# Altium project PCB_Project.PrjPcb (part 1 of 3)
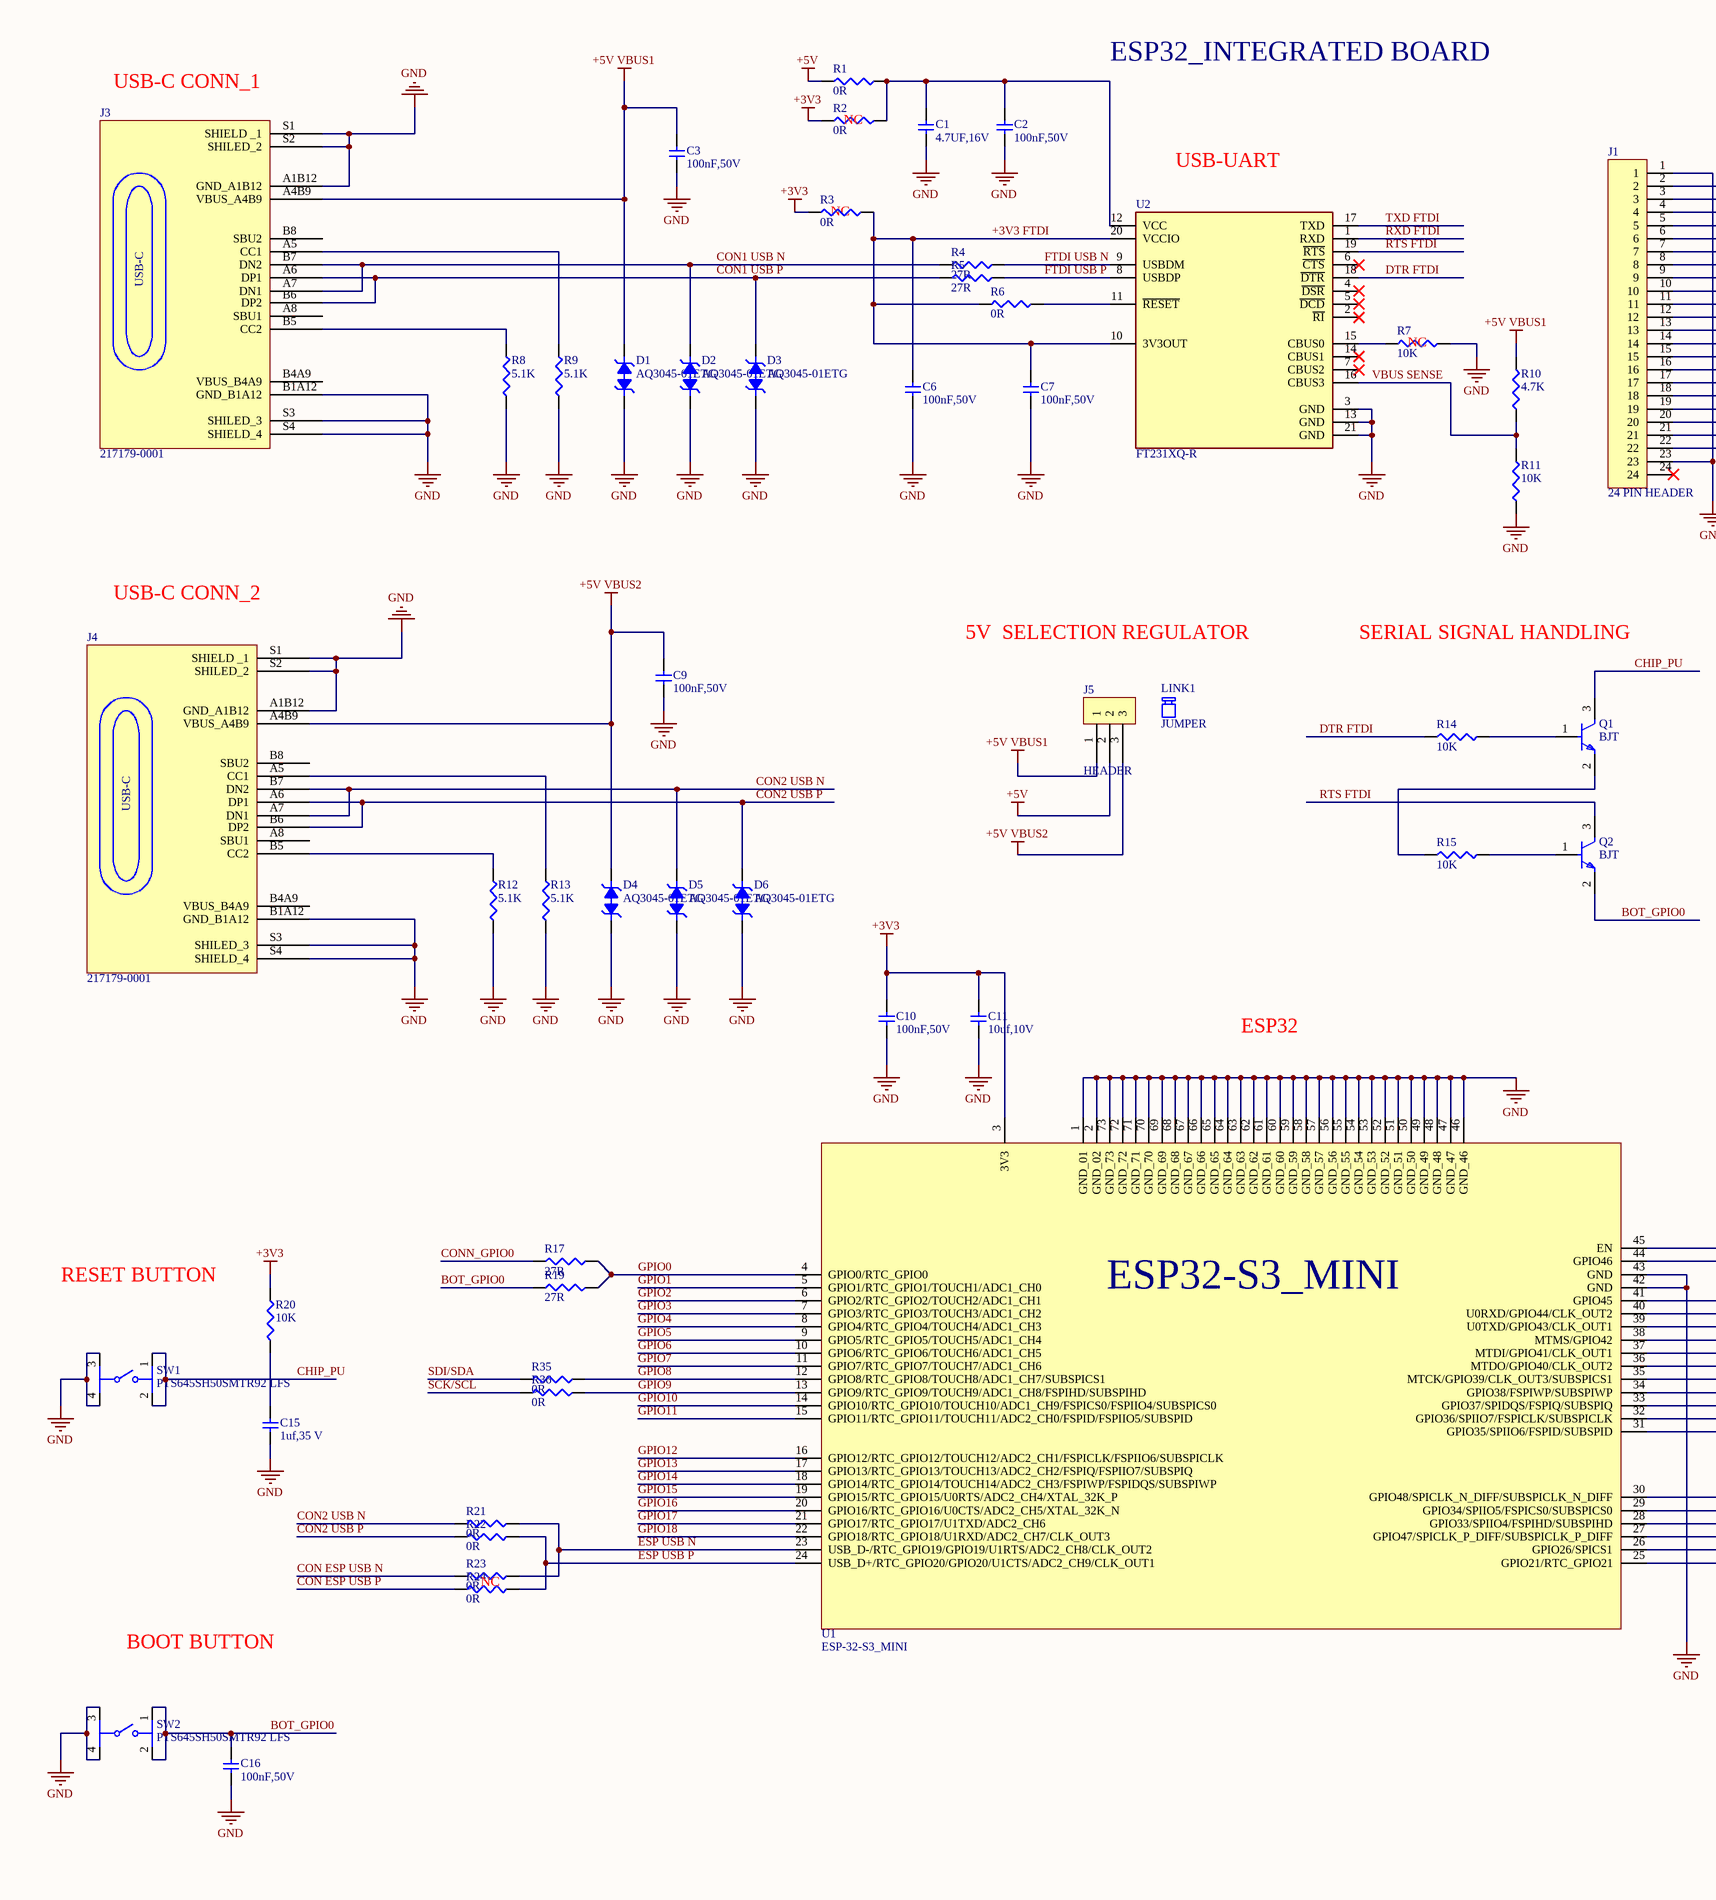
[diagram p0: esp.SchDoc, left]
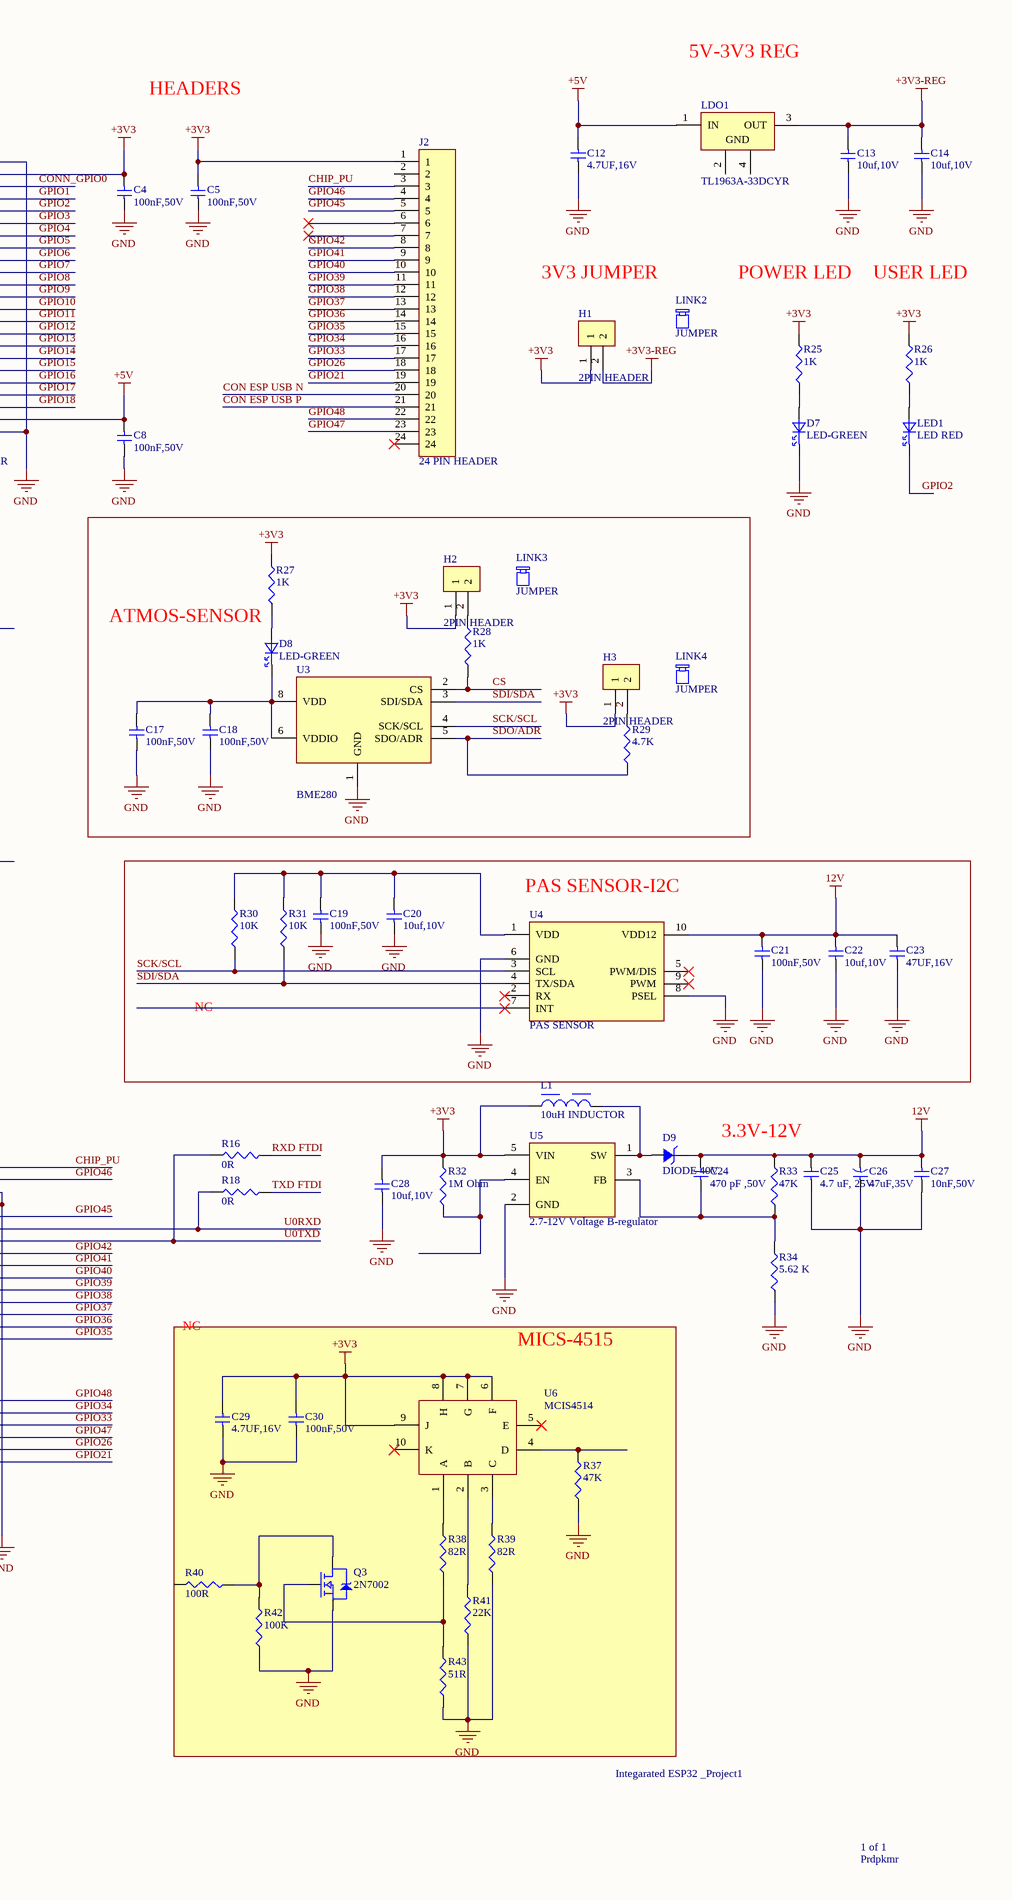
[diagram p1: esp.SchDoc, right]
1 sheet, 108 parts. Net scope: global (net labels, ports and power ports of the same name join across sheets).
Board file: PCB1.PcbDoc

## Sheet esp.SchDoc
size A2; SheetNumber: 1; SheetTotal: 1

### Parts
C1  4.7UF,16V  [CAPC1005X55N]
C2  100nF,50V  [CAPC1005X55N]
C3  100nF,50V  [CAPC1005X55N]
C4  100nF,50V  [CAPC1005X55N]
C5  100nF,50V  [CAPC1005X55N]
C6  100nF,50V  [CAPC1005X55N]
C7  100nF,50V  [CAPC1005X55N]
C8  100nF,50V  [CAPC1005X55N]
C9  100nF,50V  [CAPC1005X55N]
C10  100nF,50V  [CAPC1005X55N]
C11  10uf,10V  [CAPC1005X55N]
C12  4.7UF,16V  [CAPC1005X55N]
C13  10uf,10V  [CAPC1005X55N]
C14  10uf,10V  [CAPC1005X55N]
C15  1uf,35 V  [CAPC1005X55N]
C16  100nF,50V  [CAPC1005X55N]
C17  100nF,50V  [CAPC1005X55N]
C18  100nF,50V  [CAPC1005X55N]
C19  100nF,50V  [CAPC1005X55N]
C20  10uf,10V  [CAPC1005X55N]
C21  100nF,50V  [CAPC1005X55N]
C22  10uf,10V  [CAPC1005X55N]
C23  47UF,16V  [CAPC1005X55N]
C24  470 pF ,50V  [CAPC1005X55N]
C25  4.7 uF, 25V  [CAPC1005X55N]
C26  47uF,35V
C27  10nF,50V  [CAPC1005X55N]
C28  10uf,10V  [CAPC1005X55N]
C29  4.7UF,16V  [CAPC1005X55N]
C30  100nF,50V  [CAPC1005X55N]
D1  AQ3045-01ETG  [DIODFN100X60X50-2N]
D2  AQ3045-01ETG  [DIODFN100X60X50-2N]
D3  AQ3045-01ETG  [DIODFN100X60X50-2N]
D4  AQ3045-01ETG  [DIODFN100X60X50-2N]
D5  AQ3045-01ETG  [DIODFN100X60X50-2N]
D6  AQ3045-01ETG  [DIODFN100X60X50-2N]
D7  LED-GREEN  [LED0402_G]
D8  LED-GREEN  [LED0402_G]
D9  DIODE 40V
H1  2PIN HEADER  [HDR_1X2-1.27MM]
H2  2PIN HEADER  [HDR_1X2-1.27MM]
H3  2PIN HEADER  [HDR_1X2-1.27MM]
J1  24 PIN HEADER  [hdr_1x24]
J2  24 PIN HEADER  [hdr_1x24]
J3  217179-0001  [FP-2171790001-MFG]
J4  217179-0001  [FP-2171790001-MFG]
J5  HEADER  [HDR_1X3_1.27mm]
L1  10uH INDUCTOR  [WE-LQS_2010]
LDO1  TL1963A-33DCYR  [DCY0004A_N]
LED1  LED RED  [LED0402_R]
LINK1  JUMPER
LINK2  JUMPER
LINK3  JUMPER
LINK4  JUMPER
Q1  BJT  [FP-SS8050-G-IPC_B]
Q2  BJT  [FP-SS8050-G-IPC_B]
Q3  2N7002  [SOT95P240X111-3N]
R1  0R  [RESC1005X37N]
R2  0R  [RESC1005X37N]
R3  0R  [RESC1005X37N]
R4  27R  [RESC1005X37N]
R5  27R  [RESC1005X37N]
R6  0R  [RESC1005X37N]
R7  10K  [RESC1005X37N]
R8  5.1K  [RESC1005X37N]
R9  5.1K  [RESC1005X37N]
R10  4.7K  [RESC1005X37N]
R11  10K  [RESC1005X37N]
R12  5.1K  [RESC1005X37N]
R13  5.1K  [RESC1005X37N]
R14  10K  [RESC1005X37N]
R15  10K  [RESC1005X37N]
R16  0R  [RESC1005X37N]
R17  27R  [RESC1005X37N]
R18  0R  [RESC1005X37N]
R19  27R  [RESC1005X37N]
R20  10K  [RESC1005X37N]
R21  0R  [RESC1005X37N]
R22  0R  [RESC1005X37N]
R23  0R  [RESC1005X37N]
R24  0R  [RESC1005X37N]
R25  1K  [RESC1005X37N]
R26  1K  [RESC1005X37N]
R27  1K  [RESC1005X37N]
R28  1K  [RESC1005X37N]
R29  4.7K  [RESC1005X37N]
R30  10K  [RESC1005X37N]
R31  10K  [RESC1005X37N]
R32  1M Ohm  [RESC1005X37N]
R33  47K  [RESC1005X37N]
R34  5.62 K  [RESC1005X37N]
R35  0R  [RESC1005X37N]
R36  0R  [RESC1005X37N]
R37  47K  [RESC1005X37N]
R38  82R  [RESC1005X37N]
R39  82R  [RESC1005X37N]
R40  100R  [RESC1005X37N]
R41  22K  [RESC1005X37N]
R42  100K  [RESC1005X37N]
R43  51R  [RESC1005X37N]
SW1  PTS645SH50SMTR92 LFS  [FP-PTS645SH50SMTR92LFS-MFG]
SW2  PTS645SH50SMTR92 LFS  [FP-PTS645SH50SMTR92LFS-MFG]
U1  ESP-32-S3_MINI  [XCVR_ESP32-S3-MINI-1-N8]
U2  FT231XQ-R  [FP-QFN-20-IPC_B]
U3  BME280  [PSON65P250X250X100-8N]
U4  PAS SENSOR  [PQFN50P300X300X80-16N]
U5  2.7-12V Voltage B-regulator  [SOT95P280X145-5N]
U6  MCIS4514

### Blocks framed on the sheet
ATMOS-SENSOR: C17 C18 D8 H2 H3 LINK3 LINK4 R27-R29 U3
PAS SENSOR-I2C: C19-C23 R30 R31 U4
MICS-4515: C29 C30 Q3 R37-R43 U6

### Nets
12V: C21.2 C22.2 C23.2 C24.2 C25.2 C26.2 C27.2 D9.2 R33.2 U4.10(VDD12)
+3V3: C4.2 C5.2 C10.2 C11.2 C28.2 C29.2 C30.2 H1.1 H2.1 H3.1 J1.2 J2.1 L1.1 R2.2 R3.2 R20.1 R25.2 R26.2 R27.2 R32.2 U1.3(3V3) U5.5(VIN) U6.6(F) U6.7(G) U6.8(H) U6.9(J)
+3V3-REG: C13.2 C14.2 H1.2 LDO1.3(OUT)
+5V: C8.2 C12.1 J1.22 J5.2 LDO1.1(IN) R1.2
+5V VBUS1: C3.2 D1.1 J3.A4B9(VBUS_A4B9) J5.1 R10.2
+5V VBUS2: C9.2 D4.1 J4.A4B9(VBUS_A4B9) J5.3
GND: C1.2 C2.1 C3.1 C4.1 C5.1 C6.1 C7.1 C8.1 C9.1 C10.1 C11.1 C12.2 C13.1 C14.1 C15.1 C16.1 C17.1 C18.1 C19.1 C20.1 C21.1 C22.1 C23.1 C25.1 C26.1 C27.1 C28.1 C29.1 C30.1 D1.2 D2.2 D3.2 D4.2 D5.2 D6.2 D7.1 J1.1 J1.23 J3.A1B12(GND_A1B12) J3.B1A12(GND_B1A12) J3.S1(SHIELD__1) J3.S2(SHILED_2) J3.S3(SHILED_3) J3.S4(SHIELD_4) J4.A1B12(GND_A1B12) J4.B1A12(GND_B1A12) J4.S1(SHIELD__1) J4.S2(SHILED_2) J4.S3(SHILED_3) J4.S4(SHIELD_4) Q3.3 R7.1 R8.2 R9.2 R11.2 R12.2 R13.2 R34.1 R37.1 R39.1 R41.1 R42.1 R43.1 SW1.3 SW1.4 SW2.3 SW2.4 U1.1(GND_01) U1.2(GND_02) U1.42(GND) U1.43(GND) U1.46(GND_46) U1.47(GND_47) U1.48(GND_48) U1.49(GND_49) U1.50(GND_50) U1.51(GND_51) U1.52(GND_52) U1.53(GND_53) U1.54(GND_54) U1.55(GND_55) U1.56(GND_56) U1.57(GND_57) U1.58(GND_58) U1.59(GND_59) U1.60(GND_60) U1.61(GND_61) U1.62(GND_62) U1.63(GND_63) U1.64(GND_64) U1.65(GND_65) U1.66(GND_66) U1.67(GND_67) U1.68(GND_68) U1.69(GND_69) U1.70(GND_70) U1.71(GND_71) U1.72(GND_72) U1.73(GND_73) U2.3(GND) U2.13(GND) U2.21(GND) U3.1(GND) U4.6(GND) U4.8(PSEL) U5.2(GND)
+3V3 FTDI: C6.2 C7.2 R3.1 R6.2 U2.10(3V3OUT) U2.20(VCCIO)
BOT_GPIO0: C16.2 Q2.2(E) R19.1 SW2.1 SW2.2
CHIP_PU: J2.3 Q1.3(C) SW1.1 SW1.2 U1.45(EN)
CON1 USB N: D2.1 J3.A7(DN1) J3.B7(DN2) R4.1
CON1 USB P: D3.1 J3.A6(DP1) J3.B6(DP2) R5.1
CON2 USB N: D5.1 J4.A7(DN1) J4.B7(DN2) R21.2
CON2 USB P: D6.1 J4.A6(DP1) J4.B6(DP2) R22.2
CON ESP USB N: J2.20 R23.2
CON ESP USB P: J2.21 R24.2
CONN_GPIO0: J1.3 R17.1
CS: R28.2 U3.2(CS)
DTR FTDI: R14.1 U2.18(~{DTR})
ESP USB N: R21.1 R23.1 U1.23(USB_D-/RTC_GPIO19/GPIO19/U1RTS/ADC2_CH8/CLK_OUT2)
ESP USB P: R22.1 R24.1 U1.24(USB_D+/RTC_GPIO20/GPIO20/U1CTS/ADC2_CH9/CLK_OUT1)
FTDI USB N: R4.2 U2.9(USBDM)
FTDI USB P: R5.2 U2.8(USBDP)
GPIO0: R17.2 R19.2 U1.4(GPIO0/RTC_GPIO0)
GPIO1: J1.4 U1.5(GPIO1/RTC_GPIO1/TOUCH1/ADC1_CH0)
GPIO2: J1.5 LED1.1 U1.6(GPIO2/RTC_GPIO2/TOUCH2/ADC1_CH1)
GPIO3: J1.6 U1.7(GPIO3/RTC_GPIO3/TOUCH3/ADC1_CH2)
GPIO4: J1.7 U1.8(GPIO4/RTC_GPIO4/TOUCH4/ADC1_CH3)
GPIO5: J1.8 U1.9(GPIO5/RTC_GPIO5/TOUCH5/ADC1_CH4)
GPIO6: J1.9 U1.10(GPIO6/RTC_GPIO6/TOUCH6/ADC1_CH5)
GPIO7: J1.10 U1.11(GPIO7/RTC_GPIO7/TOUCH7/ADC1_CH6)
GPIO8: J1.11 R35.1 U1.12(GPIO8/RTC_GPIO8/TOUCH8/ADC1_CH7/SUBSPICS1)
GPIO9: J1.12 R36.1 U1.13(GPIO9/RTC_GPIO9/TOUCH9/ADC1_CH8/FSPIHD/SUBSPIHD)
GPIO10: J1.13 U1.14(GPIO10/RTC_GPIO10/TOUCH10/ADC1_CH9/FSPICS0/FSPIIO4/SUBSPICS0)
GPIO11: J1.14 U1.15(GPIO11/RTC_GPIO11/TOUCH11/ADC2_CH0/FSPID/FSPIIO5/SUBSPID)
GPIO12: J1.15 U1.16(GPIO12/RTC_GPIO12/TOUCH12/ADC2_CH1/FSPICLK/FSPIIO6/SUBSPICLK)
GPIO13: J1.16 U1.17(GPIO13/RTC_GPIO13/TOUCH13/ADC2_CH2/FSPIQ/FSPIIO7/SUBSPIQ)
GPIO14: J1.17 U1.18(GPIO14/RTC_GPIO14/TOUCH14/ADC2_CH3/FSPIWP/FSPIDQS/SUBSPIWP)
GPIO15: J1.18 U1.19(GPIO15/RTC_GPIO15/U0RTS/ADC2_CH4/XTAL_32K_P)
GPIO16: J1.19 U1.20(GPIO16/RTC_GPIO16/U0CTS/ADC2_CH5/XTAL_32K_N)
GPIO17: J1.20 U1.21(GPIO17/RTC_GPIO17/U1TXD/ADC2_CH6)
GPIO18: J1.21 U1.22(GPIO18/RTC_GPIO18/U1RXD/ADC2_CH7/CLK_OUT3)
GPIO21: J2.19 U1.25(GPIO21/RTC_GPIO21)
GPIO26: J2.18 U1.26(GPIO26/SPICS1)
GPIO33: J2.17 U1.28(GPIO33/SPIIO4/FSPIHD/SUBSPIHD)
GPIO34: J2.16 U1.29(GPIO34/SPIIO5/FSPICS0/SUBSPICS0)
GPIO35: J2.15 U1.31(GPIO35/SPIIO6/FSPID/SUBSPID)
GPIO36: J2.14 U1.32(GPIO36/SPIIO7/FSPICLK/SUBSPICLK)
GPIO37: J2.13 U1.33(GPIO37/SPIDQS/FSPIQ/SUBSPIQ)
GPIO38: J2.12 U1.34(GPIO38/FSPIWP/SUBSPIWP)
GPIO39: J2.11 U1.35(MTCK/GPIO39/CLK_OUT3/SUBSPICS1)
GPIO40: J2.10 U1.36(MTDO/GPIO40/CLK_OUT2)
GPIO41: J2.9 U1.37(MTDI/GPIO41/CLK_OUT1)
GPIO42: J2.8 U1.38(MTMS/GPIO42)
GPIO45: J2.5 U1.41(GPIO45)
GPIO46: J2.4 U1.44(GPIO46)
GPIO47: J2.23 U1.27(GPIO47/SPICLK_P_DIFF/SUBSPICLK_P_DIFF)
GPIO48: J2.22 U1.30(GPIO48/SPICLK_N_DIFF/SUBSPICLK_N_DIFF)
RTS FTDI: Q2.3(C) U2.19(~{RTS})
RXD FTDI: R16.1 U2.1(RXD)
SCK/SCL: R30.1 R36.2 U3.4(SCK/SCL) U4.3(SCL)
SDI/SDA: R31.1 R35.2 U3.3(SDI/SDA) U4.4(TX/SDA)
SDO/ADR: R29.1 U3.5(SDO/ADR)
TXD FTDI: R18.1 U2.17(TXD)
U0RXD: R18.2 U1.40(U0RXD/GPIO44/CLK_OUT2)
U0TXD: R16.2 U1.39(U0TXD/GPIO43/CLK_OUT1)
VBUS SENSE: R10.1 R11.1 U2.16(CBUS3)
NetC1_1: C1.1 C2.2 R1.1 R2.1 U2.12(VCC)
NetC15_2: C15.2 R20.2
NetC17_2: C17.2 C18.2 D8.1 U3.6(VDDIO) U3.8(VDD)
NetC19_2: C19.2 C20.2 R30.2 R31.2 U4.1(VDD)
NetC24_1: C24.1 R33.1 R34.2 U5.3(FB)
NetD7_2: D7.2 R25.1
NetD8_2: D8.2 R27.1
NetD9_1: D9.1 L1.2 U5.1(SW)
NetH2_2: H2.2 R28.1
NetH3_2: H3.2 R29.2
NetJ3_A5: J3.A5(CC1) R9.1
NetJ3_B5: J3.B5(CC2) R8.1
NetJ4_A5: J4.A5(CC1) R13.1
NetJ4_B5: J4.B5(CC2) R12.1
NetLED1_2: LED1.2 R26.1
NetQ1_1: Q1.1(B) R14.2
NetQ1_2: Q1.2(E) R15.1
NetQ2_1: Q2.1(B) R15.2
NetQ3_1: Q3.1 R38.1 R43.2
NetQ3_2: Q3.2 R40.1 R42.2
NetR6_1: R6.1 U2.11(~{RESET})
NetR7_2: R7.2 U2.15(CBUS0)
NetR32_1: R32.1 U5.4(EN)
NetR37_2: R37.2 U6.4(D)
NetR38_2: R38.2 U6.1(A)
NetR39_2: R39.2 U6.3(C)
NetR41_2: R41.2 U6.2(B)

Not connected (* = marked no-connect by the designer): J1 24*; J2 2 6* 7* 24*; J3 A8(SBU1) B4A9(VBUS_B4A9) B8(SBU2); J4 A8(SBU1) B4A9(VBUS_B4A9) B8(SBU2); LDO1 2(GND) 4(GND); R40 2; U2 2(~{RI})* 4(~{DSR})* 5(~{DCD})* 6(~{CTS})* 7(CBUS2)* 14(CBUS1)*; U4 2(RX)* 5(PWM/DIS)* 7(INT)* 9(PWM)*; U6 5(E)* 10(K)*

### Notes on the sheet
- (near J3) USB-C CONN_1
- ESP32_INTEGRATED BOARD
- 5V-3V3 REG
- (near R2) NC
- HEADERS
- (near R3) NC
- USB-UART
- (near R7) NC
- 3V3 JUMPER
- POWER LED
- USER LED
- USB-C CONN_2
- 5V  SELECTION REGULATOR
- SERIAL SIGNAL HANDLING
- ESP32
- NC
- 3.3V-12V
- RESET BUTTON
- BOOT BUTTON
- Integarated ESP32 _Project1
- Prdpkmr
- 1 of 1
- (in symbol 217179-0001) USB-C
- (in symbol ESP32-S3-MINI-1-N8) ESP32-S3_MINI